# Altium project FIT_PM12_v1.1.PrjPcb (part 5 of 13)

## Sheet PM12_P1V8.SchDoc: FIT_PM12 board
size 420 x 297 mm; CheckedBy: G.Kasprowicz; Author: INR Moscow; CompanyName: WUT ISE; DrawnBy: M.Podgórski; Organization: WUT ISE; Address1: PW ISE; Address2: Nowowiejska 15/19 00-665 Warsaw; Address3: gkasprow@gmail.com; DocumentNumber: 20; Revision: 2; SheetNumber: 21; SheetTotal: 34; ModifiedBy: -; CheckedDate: -; Title2: P1V8 PSU; DivGrp: WUT ISE; Designer: INR RAS; ModifiedDate: -; ProjectName: Sensor Box
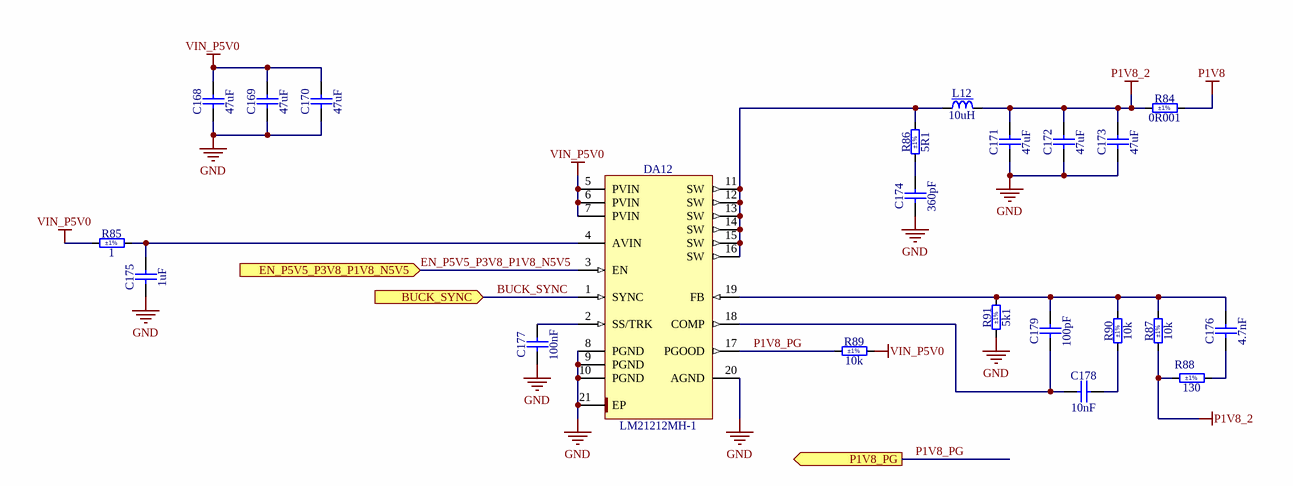
[diagram p13: PM12_P1V8.SchDoc]

### Parts
C168  47uF  [CAPC3225X270N]
C169  47uF  [CAPC3225X270N]
C170  47uF  [CAPC3225X270N]
C171  47uF  [CAPC3225X270N]
C172  47uF  [CAPC3225X270N]
C173  47uF  [CAPC3225X270N]
C174  360pF  [CAPC2013X145N]
C175  1uF  [CAPC2012X140N]
C176  4.7nF  [CAPC2012X135N]
C177  100nF  [CAPC2012X135N]
C178  10nF  [CAPC2012X135N]
C179  100pF  [CAPC2012X135N]
DA12  LM21212MH-1  [TEXAS_PWP0020AA]
L12  10uH  [IND_VISHAY_IHPL4040DZ-01]
R84  0R001  Tolerance: ±1%  [RESC_BOURNS_CRE2512_0R001-0R004]
R85  1  Tolerance: ±1%  [RESC2012X60N]
R86  5R1  Tolerance: ±1%  [RESC2012X60N]
R87  10k  Tolerance: ±1%  [RESC2012X60N]
R88  130  Tolerance: ±1%  [RESC2012X60N]
R89  10k  Tolerance: ±1%  [RESC2012X60N]
R90  10k  Tolerance: ±1%  [RESC2012X60N]
R91  5k1  Tolerance: ±1%  [RESC2012X60N]

### Ports
BUCK_SYNC (in), EN_P5V5_P3V8_P1V8_N5V5 (in), P1V8_PG (out)

### Nets
GND: C168.1 C169.1 C170.1 C171.1 C172.1 C173.1 C174.1 C175.1 C177.1 DA12.8(PGND) DA12.9(PGND) DA12.10(PGND) DA12.20(AGND) DA12.21(EP) R91.1
P1V8: R84.2
P1V8_2: C171.2 C172.2 C173.2 L12.2 R84.1 R87.1 R88.2
VIN_P5V0: C168.2 C169.2 C170.2 DA12.5(PVIN) DA12.6(PVIN) DA12.7(PVIN) R85.1 R89.2  [project net P3V3]
BUCK_SYNC: DA12.1(SYNC) ; port BUCK_SYNC
EN_P5V5_P3V8_P1V8_N5V5: DA12.3(EN) ; port EN_P5V5_P3V8_P1V8_N5V5
P1V8_PG: DA12.17(PGOOD) R89.1 ; port P1V8_PG
NetC174_2: C174.2 R86.1
NetC175_2: C175.2 DA12.4(AVIN) R85.2
NetC176_1: C176.1 R88.1
NetC176_2: C176.2 C179.2 DA12.19(FB) R87.2 R90.2 R91.2
NetC177_2: C177.2 DA12.2(SS/TRK)
NetC178_1: C178.1 R90.1
NetC178_2: C178.2 C179.1 DA12.18(COMP)
NetDA12_11: DA12.11(SW) DA12.12(SW) DA12.13(SW) DA12.14(SW) DA12.15(SW) DA12.16(SW) L12.1 R86.2

### Notes on the sheet
- Project/Equipment
- Document
- Designer
- Drawn by
- Check.by
- Copyright WUT ISE 2024.
  This documentation describes Open Hardware and is licensed under the CERN OHL v.2. You may redistribute and modify this documentation under the terms of the CERN OHL v.2. (http://ohwr.org/CERNOHL). This documentation is distributed WITHOUT ANY EXPRESS OR IMPLIED WARRANTY, INCLUDING OF MERCHANTABILITY, SATISFACTORY QUALITY AND FITNESS FOR A PARTICULAR PURPOSE. Please see the CERN OHL v.2 for applicable conditions.
- Contact
- File
- Last Mod.
- Print Date
- Sheet
- Size
- A3
- of
- Rev

### Library data of the parts
C168-C173 = CC1210_47UF_16V_20%_X5R: as C235 on sheet PM12_P3V8; Part Number: CC1210_47UF_16V_20%_X5R; Component Kind: Standard; Component Type: Standard; Pin Count: 2; Value: 47uF; Status: None; Manufacturer Part Number: CC1210_47UF_16V_20%_X5R; Case: 1210; Mounted: Yes; Socket: No; SMD: Yes; Sense: No; Manufacturer1 Example: TAIYO YUDEN; Manufacturer1 ComponentHeight: 2.7mm; HelpURL: \\cern.ch\dfs\Applications\Altium\Datasheets\CC1210_X5R_TAIYO-YUDEN_HIGH-VALUE.pdf; Author: CERN DEM MR; CreateDate: 03.02.2016; LatestRevisionDate: 03.02.2016
C174 = CC0805_360PF_50V_5%_C0G: as C248 on sheet PM12_P3V8; Part Number: CC0805_360PF_50V_5%_C0G; Component Kind: Standard; Component Type: Standard; Pin Count: 2; Value: 360pF; Status: None; Manufacturer Part Number: CC0805_360PF_50V_5%_C0G; Case: 0805; Mounted: Yes; Socket: No; SMD: Yes; Sense: No; Manufacturer1 Example: YAGEO PHYCOMP; Manufacturer1 ComponentHeight: 1.45mm; HelpURL: \\cern.ch\dfs\Applications\Altium\Datasheets\CC0805_NP0_YAGEO.pdf; Author: CERN DEM HF; CreateDate: 30.05.2024; LatestRevisionDate: 30.05.2024
C175 = CC0805_1UF_25V_10%_X7R: as C95 on sheet PM12_LDO; Part Number: CC0805_1UF_25V_10%_X7R; Component Kind: Standard; Component Type: Standard; Pin Count: 2; Value: 1uF; Status: Preferred; Manufacturer Part Number: CC0805_1UF_25V_10%_X7R; Case: 0805; Mounted: Yes; Socket: No; SMD: Yes; Sense: No; Manufacturer1 Example: KEMET; Manufacturer1 ComponentHeight: 1.4mm; HelpURL: \\cern.ch\dfs\Applications\Altium\Datasheets\CC0805_X7R_KEMET.pdf; Author: CERN DEM JLC; CreateDate: 23.03.2009; LatestRevisionDate: 23.03.2009
C176 = CC0805_4.7NF_50V_10%_X7R: as C250 on sheet PM12_P3V8; Part Number: CC0805_4.7NF_50V_10%_X7R; Component Kind: Standard; Component Type: Standard; Pin Count: 2; Value: 4.7nF; Status: Preferred; Manufacturer Part Number: CC0805_4.7NF_50V_10%_X7R; Case: 0805; Mounted: Yes; Socket: No; SMD: Yes; Sense: No; Manufacturer1 Example: PHYCOMP; Manufacturer1 ComponentHeight: 0.94mm; HelpURL: \\cern.ch\dfs\Applications\Altium\Datasheets\CC0805_X7R_PHYCOMP.pdf; Author: CERN DEM JLC; CreateDate: 03.12.2007; LatestRevisionDate: 03.12.2007
C177 = CC0805_100NF_50V_10%_X7R: as C251 on sheet PM12_P3V8; Part Number: CC0805_100NF_50V_10%_X7R; Component Kind: Standard; Component Type: Standard; Pin Count: 2; Value: 100nF; Status: None; Manufacturer Part Number: CC0805_100NF_50V_10%_X7R; Case: 0805; Mounted: Yes; Socket: No; SMD: Yes; Sense: No; Manufacturer1 Example: TDK; Manufacturer1 ComponentHeight: 1mm; HelpURL: \\cern.ch\dfs\Applications\Altium\Datasheets\CC0805_X7R_TDK_C.pdf; Author: CERN DEM JLC; CreateDate: 03.12.2007; LatestRevisionDate: 22.04.2015
C178 = CC0805_10NF_50V_10%_X7R: as C252 on sheet PM12_P3V8; Part Number: CC0805_10NF_50V_10%_X7R; Component Kind: Standard; Component Type: Standard; Pin Count: 2; Value: 10nF; Status: Preferred; Manufacturer Part Number: CC0805_10NF_50V_10%_X7R; Case: 0805; Mounted: Yes; Socket: No; SMD: Yes; Sense: No; Manufacturer1 Example: KEMET; Manufacturer1 ComponentHeight: 0.88mm; HelpURL: \\cern.ch\dfs\Applications\Altium\Datasheets\CC0805_X7R_KEMET.pdf; Author: CERN DEM JLC; CreateDate: 03.12.2007; LatestRevisionDate: 22.04.2015
C179 = CC0805_100PF_50V_5%_NP0: as C260 on sheet PM12_P3V8; Part Number: CC0805_100PF_50V_5%_NP0; Component Kind: Standard; Component Type: Standard; Pin Count: 2; Value: 100pF; Status: Preferred; Manufacturer Part Number: CC0805_100PF_50V_5%_NP0; Case: 0805; Mounted: Yes; Socket: No; SMD: Yes; Sense: No; Manufacturer1 Example: PHYCOMP; Manufacturer1 ComponentHeight: 1.35mm; HelpURL: \\cern.ch\dfs\Applications\Altium\Datasheets\CC0805_NP0_PHYCOMP.pdf; Author: CERN DEM JLC; CreateDate: 03.12.2007; LatestRevisionDate: 03.12.2007
DA12 = LM21212MH-1: as DA23 on sheet PM12_P3V8; Part Number: LM21212MH-1; Component Kind: Standard; Component Type: Standard; Device: LM21212MH-1; PackageDescription: TEXAS Case Style PWP0020AA, SOP, 0.65mm Pitch; 20 Pin, 4.40mm W X 6.50mm L X 1.10mm H body (w/thermal tab 3.4mm X 4.6mm  ), IPC Medium Density; Part Description: 2.95-V To 5.5-V, 12-A, Voltage-Mode Synchronous Buck Regulator with Frequency Synchronization; Manufacturer Part Number: LM21212MH-1; Pin Count: 21; Case: TSSOP20; Mounted: Yes; Socket: No; SMD: Yes; Sense: No; ComponentHeight: 1.1mm; HelpURL: \\cern.ch\dfs\Applications\Altium\Datasheets\LM21212MH-1.pdf; Author: CERN DEM HF; CreateDate: 05.06.2024; LatestRevisionDate: 05.06.2024
L12 = IND4040_10UH_20%_VISHAY_IHLP-4040DZ-01: as L15 on sheet PM12_P3V8; Part Number: IND4040_10UH_20%_VISHAY_IHLP-4040DZ-01; Component Kind: Standard; Component Type: Standard; Pin Count: 2; Value: 10uH; Case: 4040; Mounted: Yes; Socket: No; SMD: Yes; Sense: No; ComponentHeight: 4mm; HelpURL: \\cern.ch\dfs\Applications\Altium\Datasheets\IND_VISHAY_IHLP4040DZ-01.pdf; Author: CERN DEM HF; CreateDate: 31.05.2024; LatestRevisionDate: 31.05.2024
R84 = R2512_0R001_1%_3W_50PPM_BOURNS_CRE2512: as R15 on sheet PM12_P3V8; Part Number: R2512_0R001_1%_3W_50PPM_BOURNS_CRE2512; Component Kind: Standard; Component Type: Standard; Pin Count: 2; Value: 0R001; Status: None; Case: 2512; Mounted: Yes; Sense: No; Socket: No; SMD: Yes; ComponentHeight: 0.9mm; HelpURL: \\cern.ch\dfs\Applications\Altium\Datasheets\R2512_BOURNS_CRE2512.pdf; Author: CERN DEM BC; CreateDate: 13.10.2021; LatestRevisionDate: 13.10.2021
R85 = R0805_1R_1%_0.125W_100PPM: as R58 on sheet PM12_LDO; Part Number: R0805_1R_1%_0.125W_100PPM; Component Kind: Standard; Component Type: Standard; Pin Count: 2; Value: 1; Status: None; Manufacturer Part Number: R0805_1R_1%_0.125W_100PPM; Case: 0805; Mounted: Yes; Sense: No; Socket: No; SMD: Yes; Manufacturer1 Example: VISHAY; Manufacturer1 ComponentHeight: 0.6mm; HelpURL: \\cern.ch\dfs\Applications\Altium\Datasheets\R0805_VISHAY_CRCW e3.pdf; Author: CERN DEM HF; CreateDate: 07.06.2024; LatestRevisionDate: 07.06.2024
R86 = R0805_5R1_1%_0.125W_100PPM: as R18 on sheet PM12_P3V8; Part Number: R0805_5R1_1%_0.125W_100PPM; Component Kind: Standard; Component Type: Standard; Pin Count: 2; Value: 5R1; Status: None; Manufacturer Part Number: R0805_5R1_1%_0.125W_100PPM; Case: 0805; Mounted: Yes; Sense: No; Socket: No; SMD: Yes; Manufacturer1 Example: VISHAY; Manufacturer1 ComponentHeight: 0.6mm; HelpURL: \\cern.ch\dfs\Applications\Altium\Datasheets\R0805_VISHAY_CRCW-HP e3.pdf; Author: CERN DEM HF; CreateDate: 07.06.2024; LatestRevisionDate: 07.06.2024
R87 R89 R90 = R0805_10K_1%_0.125W_100PPM: as R97 on sheet PM12_Supply_LED; Part Number: R0805_10K_1%_0.125W_100PPM; Component Kind: Standard; Component Type: Standard; Pin Count: 2; Value: 10k; Status: Preferred; Manufacturer Part Number: R0805_10K_1%_0.125W_100PPM; Case: 0805; Mounted: Yes; Sense: No; Socket: No; SMD: Yes; Manufacturer1 Example: NIC COMPONENT; Manufacturer1 ComponentHeight: 0.6mm; HelpURL: \\cern.ch\dfs\Applications\Altium\Datasheets\R0805_NIC_NRC.pdf; Author: CERN DEM JLC; CreateDate: 03.12.2007; LatestRevisionDate: 13.03.2008
R88 = R0805_130R_1%_0.125W_100PPM: as R139 on sheet PM12_P3V8; Part Number: R0805_130R_1%_0.125W_100PPM; Component Kind: Standard; Component Type: Standard; Pin Count: 2; Value: 130; Status: Preferred; Manufacturer Part Number: R0805_130R_1%_0.125W_100PPM; Case: 0805; Mounted: Yes; Sense: No; Socket: No; SMD: Yes; Manufacturer1 Example: NIC COMPONENT; Manufacturer1 ComponentHeight: 0.6mm; HelpURL: \\cern.ch\dfs\Applications\Altium\Datasheets\R0805_NIC_NRC.pdf; Author: CERN DEM JLC; CreateDate: 03.12.2007; LatestRevisionDate: 13.03.2008
R91 = R0805_5K1_1%_0.125W_100PPM: Resistor - 1%; Part Description: General Purpose Thick Film Chip Resistor; Manufacturer: GENERIC; Manufacturer1 Part Number: NRC10F5101TRF; Power: 0.125W; TC: ±100ppm/°C; PressFit: No; Part Number: R0805_5K1_1%_0.125W_100PPM; Component Kind: Standard; Component Type: Standard; Pin Count: 2; Value: 5k1; Status: Preferred; Manufacturer Part Number: R0805_5K1_1%_0.125W_100PPM; Case: 0805; Mounted: Yes; Sense: No; Socket: No; SMD: Yes; Manufacturer1 Example: NIC COMPONENT; Manufacturer1 ComponentHeight: 0.6mm; HelpURL: \\cern.ch\dfs\Applications\Altium\Datasheets\R0805_NIC_NRC.pdf; Author: CERN DEM JLC; CreateDate: 03.12.2007; LatestRevisionDate: 13.03.2008

## Sheet FPGA.SchDoc: FIT_PM12 board
size 420 x 297 mm; CheckedBy: G.Kasprowicz; Author: INR Moscow; CompanyName: WUT ISE; DrawnBy: M.Podgórski; Organization: WUT ISE; Address1: PW ISE; Address2: Nowowiejska 15/19 00-665 Warsaw; Address3: gkasprow@gmail.com; DocumentNumber: 34; Revision: 2; SheetNumber: 22; SheetTotal: 34; ModifiedBy: -; CheckedDate: -; Title2: FPGA TOP; DivGrp: WUT ISE; Designer: INR RAS; ModifiedDate: -; ProjectName: Sensor Box
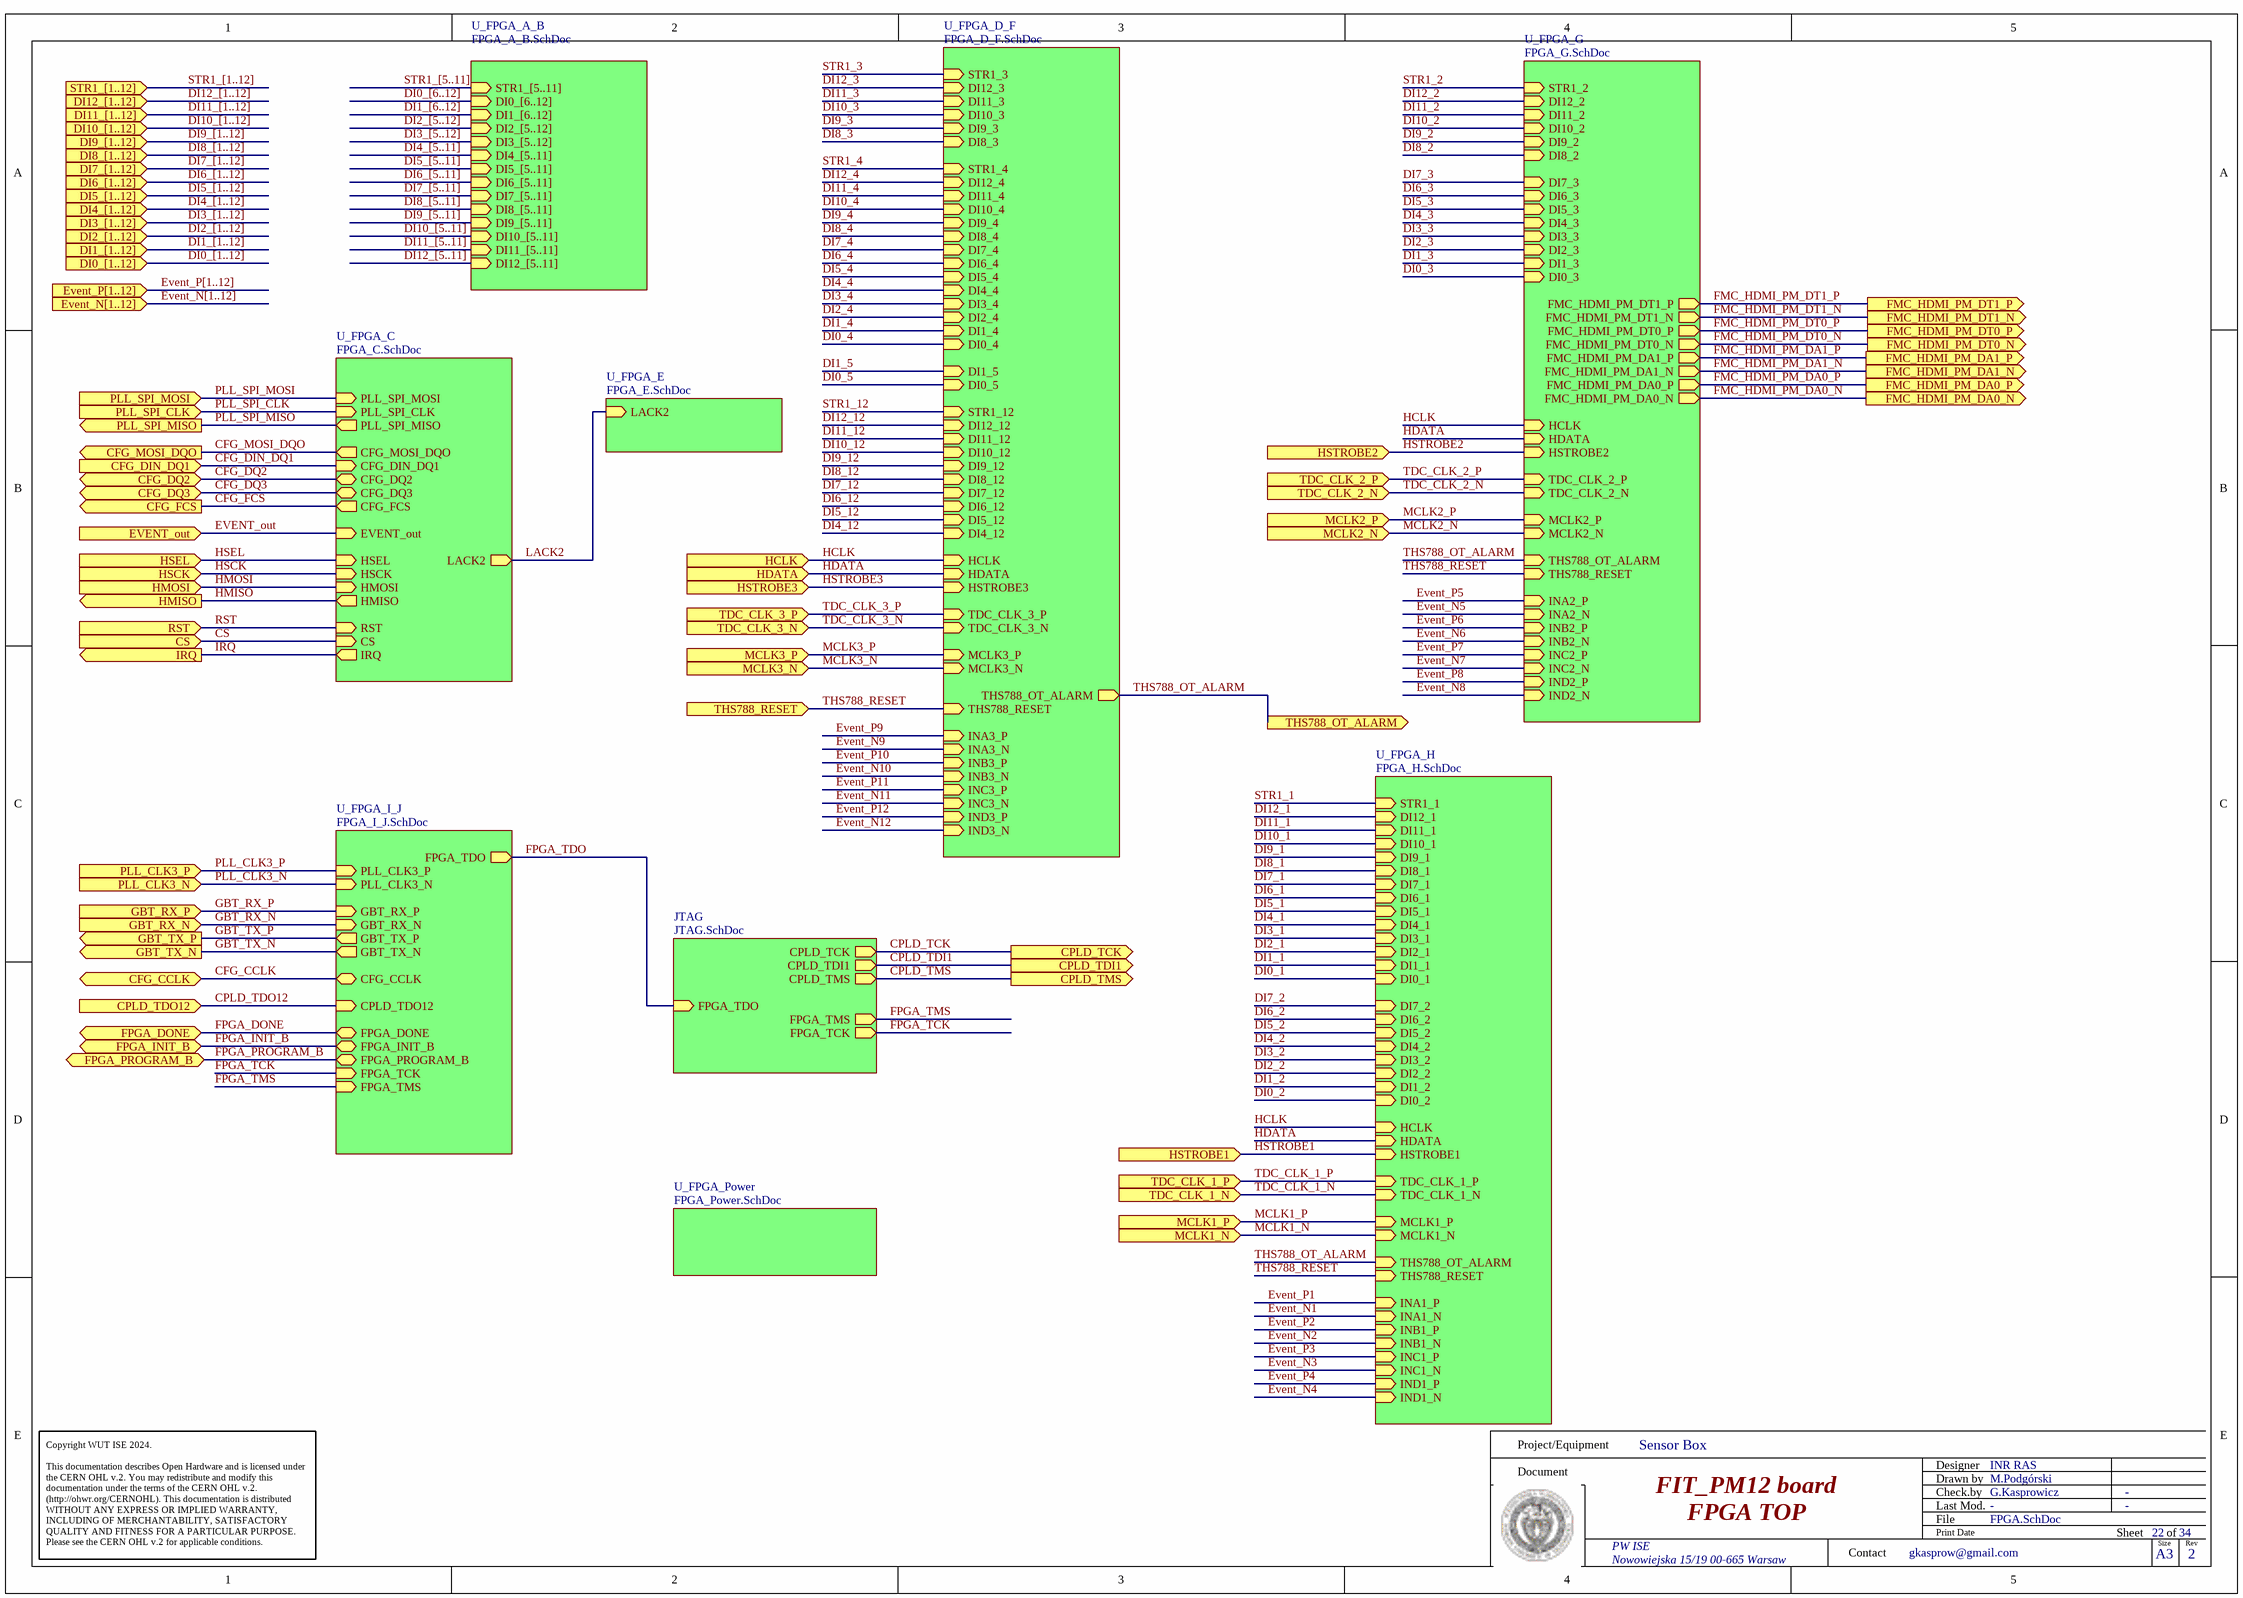
[diagram p14: FPGA.SchDoc]

### Sub-sheets
JTAG = JTAG.SchDoc: FPGA_TDO (in), FPGA_TCK (out), FPGA_TMS (out), CPLD_TDI1 (out), CPLD_TMS (out), CPLD_TCK (out)
U_FPGA_A_B = FPGA_A_B.SchDoc: STR1_[5..11] (in), DI0_[6..12] (in), DI1_[6..12] (in), DI2_[5..12] (in), DI3_[5..12] (in), DI4_[5..11] (in), DI5_[5..11] (in), DI6_[5..11] (in), DI7_[5..11] (in), DI8_[5..11] (in), DI9_[5..11] (in), DI10_[5..11] (in), DI11_[5..11] (in), DI12_[5..11] (in)
U_FPGA_C = FPGA_C.SchDoc: PLL_SPI_MOSI (in), CFG_MOSI_DQO (out), CFG_DIN_DQ1 (in), CFG_DQ2 (bidir), CFG_DQ3 (bidir), CFG_FCS (out), LACK2 (out), PLL_SPI_CLK (in), HSCK (in), EVENT_out (in), PLL_SPI_MISO (out), HMISO (out), HSEL (in), HMOSI (in), CS (in), IRQ (out), RST (in)
U_FPGA_D_F = FPGA_D_F.SchDoc: DI8_3 (in), DI4_4 (in), DI5_4 (in), DI11_4 (in), DI1_5 (in), DI12_3 (in), STR1_3 (in), STR1_4 (in), DI0_5 (in), DI2_4 (in), DI12_4 (in), DI3_4 (in), DI10_4 (in), DI9_4 (in), DI6_4 (in), DI1_4 (in), DI8_4 (in), DI0_4 (in), DI7_4 (in), DI10_3 (in), DI11_3 (in), DI9_3 (in), DI11_12 (in), DI12_12 (in), DI5_12 (in), DI7_12 (in), DI6_12 (in), DI10_12 (in), DI4_12 (in), DI8_12 (in), DI9_12 (in), STR1_12 (in), HCLK (in), HDATA (in), THS788_OT_ALARM (out), THS788_RESET (in), HSTROBE3 (in), TDC_CLK_3_P (in), TDC_CLK_3_N (in), MCLK3_P (in), MCLK3_N (in), INA3_P (in), INA3_N (in), INB3_P (in), INB3_N (in), INC3_P (in), INC3_N (in), IND3_P (in), IND3_N (in)
U_FPGA_E = FPGA_E.SchDoc: LACK2 (in)
U_FPGA_G = FPGA_G.SchDoc: DI8_2 (in), DI10_2 (in), DI9_2 (in), DI12_2 (in), DI11_2 (in), DI0_3 (in), STR1_2 (in), FMC_HDMI_PM_DA0_P (out), FMC_HDMI_PM_DA0_N (out), DI7_3 (in), DI6_3 (in), FMC_HDMI_PM_DT1_P (out), FMC_HDMI_PM_DT1_N (out), DI5_3 (in), DI4_3 (in), DI1_3 (in), DI2_3 (in), FMC_HDMI_PM_DA1_P (out), FMC_HDMI_PM_DA1_N (out), FMC_HDMI_PM_DT0_P (out), FMC_HDMI_PM_DT0_N (out), DI3_3 (in), HCLK (in), HDATA (in), THS788_OT_ALARM (in), THS788_RESET (in), HSTROBE2 (in), TDC_CLK_2_P (in), TDC_CLK_2_N (in), MCLK2_P (in), MCLK2_N (in), INA2_P (in), INA2_N (in), INB2_P (in), INB2_N (in), INC2_P (in), INC2_N (in), IND2_P (in), IND2_N (in)
U_FPGA_H = FPGA_H.SchDoc: DI4_1 (in), DI2_1 (in), DI3_1 (in), DI5_1 (in), DI6_1 (in), DI12_1 (in), STR1_1 (in), DI1_1 (in), DI7_1 (in), DI8_1 (in), DI9_1 (in), DI10_1 (in), DI11_1 (in), DI0_1 (in), DI0_2 (in), DI3_2 (in), DI7_2 (in), DI2_2 (in), DI1_2 (in), DI6_2 (in), DI4_2 (in), DI5_2 (in), HCLK (in), HDATA (in), THS788_OT_ALARM (in), THS788_RESET (in), TDC_CLK_1_P (in), TDC_CLK_1_N (in), HSTROBE1 (in), MCLK1_P (in), MCLK1_N (in), INA1_P (in), INA1_N (in), INB1_P (in), INB1_N (in), INC1_P (in), INC1_N (in), IND1_P (in), IND1_N (in)
U_FPGA_I_J = FPGA_I_J.SchDoc: FPGA_TDO (out), CPLD_TDO12 (in), CFG_CCLK (bidir), FPGA_DONE (bidir), FPGA_INIT_B (bidir), FPGA_PROGRAM_B (bidir), FPGA_TMS (in), FPGA_TCK (in), GBT_TX_P (out), GBT_TX_N (out), GBT_RX_P (in), PLL_CLK3_P (in), GBT_RX_N (in), PLL_CLK3_N (in)
U_FPGA_Power = FPGA_Power.SchDoc: no entries

### Ports
CFG_CCLK (bidir), CFG_DIN_DQ1 (in), CFG_DQ2 (bidir), CFG_DQ3 (bidir), CFG_FCS (out), CFG_MOSI_DQO (out), CPLD_TCK (out), CPLD_TDI1 (out), CPLD_TDO12 (in), CPLD_TMS (out), CS (in), DI0_[1..12] (in), DI1_[1..12] (in), DI2_[1..12] (in), DI3_[1..12] (in), DI4_[1..12] (in), DI5_[1..12] (in), DI6_[1..12] (in), DI7_[1..12] (in), DI8_[1..12] (in), DI9_[1..12] (in), DI10_[1..12] (in), DI11_[1..12] (in), DI12_[1..12] (in), Event_N[1..12] (in), EVENT_out (in), Event_P[1..12] (in), FMC_HDMI_PM_DA0_N (out), FMC_HDMI_PM_DA0_P (out), FMC_HDMI_PM_DA1_N (out), FMC_HDMI_PM_DA1_P (out), FMC_HDMI_PM_DT0_N (out), FMC_HDMI_PM_DT0_P (out), FMC_HDMI_PM_DT1_N (out), FMC_HDMI_PM_DT1_P (out), FPGA_DONE (bidir), FPGA_INIT_B (bidir), FPGA_PROGRAM_B (bidir), GBT_RX_N (in), GBT_RX_P (in), GBT_TX_N (out), GBT_TX_P (out), HCLK (in), HDATA (in), HMISO (out), HMOSI (in), HSCK (in), HSEL (in), HSTROBE1 (in), HSTROBE2 (in), HSTROBE3 (in), IRQ (out), MCLK1_N (in), MCLK1_P (in), MCLK2_N (in), MCLK2_P (in), MCLK3_N (in), MCLK3_P (in), PLL_CLK3_N (in), PLL_CLK3_P (in), PLL_SPI_CLK (in), PLL_SPI_MISO (out), PLL_SPI_MOSI (in), RST (in), STR1_[1..12] (in), TDC_CLK_1_N (in), TDC_CLK_1_P (in), TDC_CLK_2_N (in), TDC_CLK_2_P (in), TDC_CLK_3_N (in), TDC_CLK_3_P (in), THS788_OT_ALARM (out), THS788_RESET (in)

### Nets
CFG_CCLK: port CFG_CCLK, sheet U_FPGA_I_J/CFG_CCLK
CFG_DIN_DQ1: port CFG_DIN_DQ1, sheet U_FPGA_C/CFG_DIN_DQ1
CFG_DQ2: port CFG_DQ2, sheet U_FPGA_C/CFG_DQ2
CFG_DQ3: port CFG_DQ3, sheet U_FPGA_C/CFG_DQ3
CFG_FCS: port CFG_FCS, sheet U_FPGA_C/CFG_FCS
CFG_MOSI_DQO: port CFG_MOSI_DQO, sheet U_FPGA_C/CFG_MOSI_DQO
CPLD_TCK: port CPLD_TCK, sheet JTAG/CPLD_TCK
CPLD_TDI1: port CPLD_TDI1, sheet JTAG/CPLD_TDI1  [project net CPLD_TDI]
CPLD_TDO12: port CPLD_TDO12, sheet U_FPGA_I_J/CPLD_TDO12  [project net CPLD_TDO]
CPLD_TMS: port CPLD_TMS, sheet JTAG/CPLD_TMS
CS: port CS, sheet U_FPGA_C/CS
EVENT_out: port EVENT_out, sheet U_FPGA_C/EVENT_out  [project net EV_IN_]
FMC_HDMI_PM_DA0_N: port FMC_HDMI_PM_DA0_N, sheet U_FPGA_G/FMC_HDMI_PM_DA0_N
FMC_HDMI_PM_DA0_P: port FMC_HDMI_PM_DA0_P, sheet U_FPGA_G/FMC_HDMI_PM_DA0_P
FMC_HDMI_PM_DA1_N: port FMC_HDMI_PM_DA1_N, sheet U_FPGA_G/FMC_HDMI_PM_DA1_N
FMC_HDMI_PM_DA1_P: port FMC_HDMI_PM_DA1_P, sheet U_FPGA_G/FMC_HDMI_PM_DA1_P
FMC_HDMI_PM_DT0_N: port FMC_HDMI_PM_DT0_N, sheet U_FPGA_G/FMC_HDMI_PM_DT0_N
FMC_HDMI_PM_DT0_P: port FMC_HDMI_PM_DT0_P, sheet U_FPGA_G/FMC_HDMI_PM_DT0_P
FMC_HDMI_PM_DT1_N: port FMC_HDMI_PM_DT1_N, sheet U_FPGA_G/FMC_HDMI_PM_DT1_N
FMC_HDMI_PM_DT1_P: port FMC_HDMI_PM_DT1_P, sheet U_FPGA_G/FMC_HDMI_PM_DT1_P
FPGA_DONE: port FPGA_DONE, sheet U_FPGA_I_J/FPGA_DONE
FPGA_INIT_B: port FPGA_INIT_B, sheet U_FPGA_I_J/FPGA_INIT_B
FPGA_PROGRAM_B: port FPGA_PROGRAM_B, sheet U_FPGA_I_J/FPGA_PROGRAM_B
FPGA_TCK: sheet U_FPGA_I_J/FPGA_TCK, sheet JTAG/FPGA_TCK
FPGA_TDO: sheet U_FPGA_I_J/FPGA_TDO, sheet JTAG/FPGA_TDO
FPGA_TMS: sheet U_FPGA_I_J/FPGA_TMS, sheet JTAG/FPGA_TMS
GBT_RX_N: port GBT_RX_N, sheet U_FPGA_I_J/GBT_RX_N
GBT_RX_P: port GBT_RX_P, sheet U_FPGA_I_J/GBT_RX_P
GBT_TX_N: port GBT_TX_N, sheet U_FPGA_I_J/GBT_TX_N
GBT_TX_P: port GBT_TX_P, sheet U_FPGA_I_J/GBT_TX_P
HCLK: port HCLK, sheet U_FPGA_H/HCLK, sheet U_FPGA_D_F/HCLK, sheet U_FPGA_G/HCLK
HDATA: port HDATA, sheet U_FPGA_H/HDATA, sheet U_FPGA_D_F/HDATA, sheet U_FPGA_G/HDATA
HMISO: port HMISO, sheet U_FPGA_C/HMISO
HMOSI: port HMOSI, sheet U_FPGA_C/HMOSI
HSCK: port HSCK, sheet U_FPGA_C/HSCK
HSEL: port HSEL, sheet U_FPGA_C/HSEL
HSTROBE1: port HSTROBE1, sheet U_FPGA_H/HSTROBE1
HSTROBE2: port HSTROBE2, sheet U_FPGA_G/HSTROBE2
HSTROBE3: port HSTROBE3, sheet U_FPGA_D_F/HSTROBE3
IRQ: port IRQ, sheet U_FPGA_C/IRQ
LACK2: sheet U_FPGA_E/LACK2, sheet U_FPGA_C/LACK2
MCLK1_N: port MCLK1_N, sheet U_FPGA_H/MCLK1_N
MCLK1_P: port MCLK1_P, sheet U_FPGA_H/MCLK1_P
MCLK2_N: port MCLK2_N, sheet U_FPGA_G/MCLK2_N
MCLK2_P: port MCLK2_P, sheet U_FPGA_G/MCLK2_P
MCLK3_N: port MCLK3_N, sheet U_FPGA_D_F/MCLK3_N
MCLK3_P: port MCLK3_P, sheet U_FPGA_D_F/MCLK3_P
PLL_CLK3_N: port PLL_CLK3_N, sheet U_FPGA_I_J/PLL_CLK3_N
PLL_CLK3_P: port PLL_CLK3_P, sheet U_FPGA_I_J/PLL_CLK3_P
PLL_SPI_CLK: port PLL_SPI_CLK, sheet U_FPGA_C/PLL_SPI_CLK
PLL_SPI_MISO: port PLL_SPI_MISO, sheet U_FPGA_C/PLL_SPI_MISO
PLL_SPI_MOSI: port PLL_SPI_MOSI, sheet U_FPGA_C/PLL_SPI_MOSI
RST: port RST, sheet U_FPGA_C/RST
TDC_CLK_1_N: port TDC_CLK_1_N, sheet U_FPGA_H/TDC_CLK_1_N
TDC_CLK_1_P: port TDC_CLK_1_P, sheet U_FPGA_H/TDC_CLK_1_P
TDC_CLK_2_N: port TDC_CLK_2_N, sheet U_FPGA_G/TDC_CLK_2_N
TDC_CLK_2_P: port TDC_CLK_2_P, sheet U_FPGA_G/TDC_CLK_2_P
TDC_CLK_3_N: port TDC_CLK_3_N, sheet U_FPGA_D_F/TDC_CLK_3_N
TDC_CLK_3_P: port TDC_CLK_3_P, sheet U_FPGA_D_F/TDC_CLK_3_P
THS788_OT_ALARM: port THS788_OT_ALARM, sheet U_FPGA_H/THS788_OT_ALARM, sheet U_FPGA_D_F/THS788_OT_ALARM, sheet U_FPGA_G/THS788_OT_ALARM
THS788_RESET: port THS788_RESET, sheet U_FPGA_H/THS788_RESET, sheet U_FPGA_D_F/THS788_RESET, sheet U_FPGA_G/THS788_RESET

### Buses and harness runs
bus DI0_[1..12] = port DI0_[1..12]
bus DI0_[6..12] = sheet U_FPGA_A_B/DI0_[6..12]
bus DI1_[1..12] = port DI1_[1..12]
bus DI1_[6..12] = sheet U_FPGA_A_B/DI1_[6..12]
bus DI2_[1..12] = port DI2_[1..12]
bus DI2_[5..12] = sheet U_FPGA_A_B/DI2_[5..12]
bus DI3_[1..12] = port DI3_[1..12]
bus DI3_[5..12] = sheet U_FPGA_A_B/DI3_[5..12]
bus DI4_[1..12] = port DI4_[1..12]
bus DI4_[5..11] = sheet U_FPGA_A_B/DI4_[5..11]
bus DI5_[1..12] = port DI5_[1..12]
bus DI5_[5..11] = sheet U_FPGA_A_B/DI5_[5..11]
bus DI6_[1..12] = port DI6_[1..12]
bus DI6_[5..11] = sheet U_FPGA_A_B/DI6_[5..11]
bus DI7_[1..12] = port DI7_[1..12]
bus DI7_[5..11] = sheet U_FPGA_A_B/DI7_[5..11]
bus DI8_[1..12] = port DI8_[1..12]
bus DI8_[5..11] = sheet U_FPGA_A_B/DI8_[5..11]
bus DI9_[1..12] = port DI9_[1..12]
bus DI9_[5..11] = sheet U_FPGA_A_B/DI9_[5..11]
bus DI10_[1..12] = port DI10_[1..12]
bus DI10_[5..11] = sheet U_FPGA_A_B/DI10_[5..11]
bus DI11_[1..12] = port DI11_[1..12]
bus DI11_[5..11] = sheet U_FPGA_A_B/DI11_[5..11]
bus DI12_[1..12] = port DI12_[1..12]
bus DI12_[5..11] = sheet U_FPGA_A_B/DI12_[5..11]
bus Event_N[1..12] = port Event_N[1..12]
bus Event_P[1..12] = port Event_P[1..12]
bus STR1_[1..12] = port STR1_[1..12]
bus STR1_[5..11] = sheet U_FPGA_A_B/STR1_[5..11]

### Notes on the sheet
- Project/Equipment
- Document
- Designer
- Drawn by
- Check.by
- Copyright WUT ISE 2024.
  This documentation describes Open Hardware and is licensed under the CERN OHL v.2. You may redistribute and modify this documentation under the terms of the CERN OHL v.2. (http://ohwr.org/CERNOHL). This documentation is distributed WITHOUT ANY EXPRESS OR IMPLIED WARRANTY, INCLUDING OF MERCHANTABILITY, SATISFACTORY QUALITY AND FITNESS FOR A PARTICULAR PURPOSE. Please see the CERN OHL v.2 for applicable conditions.
- Contact
- File
- Last Mod.
- Print Date
- Sheet
- Size
- A3
- of
- Rev